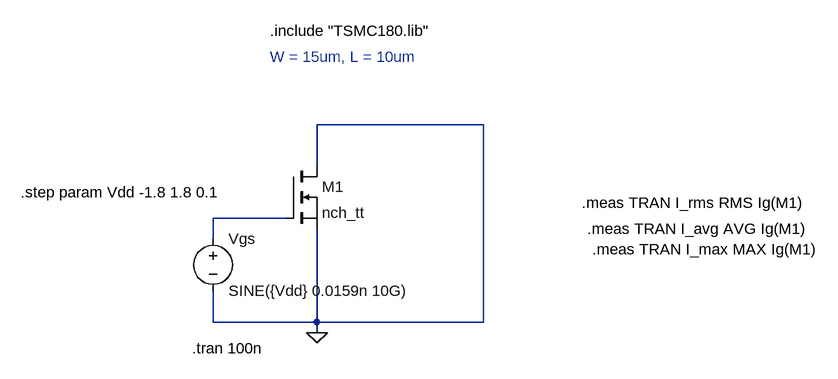
[diagram p0: schematic Q2_nmos_lc.asc]
Q2_nmos_lc.asc, the LTspice schematic file:
Version 4
SHEET 1 1020 680
WIRE 480 128 224 128
WIRE 224 192 224 128
WIRE 176 272 64 272
WIRE 64 304 64 272
WIRE 64 432 64 384
WIRE 224 432 224 288
WIRE 224 432 64 432
WIRE 480 432 480 128
WIRE 480 432 224 432
WIRE 224 448 224 432
FLAG 224 448 0
SYMBOL nmos 176 192 R0
SYMATTR InstName M1
SYMATTR Value nch_tt
SYMATTR Value2 W=15u L=10u
SYMBOL voltage 64 288 R0
WINDOW 123 0 0 Left 0
WINDOW 39 0 0 Left 0
SYMATTR InstName Vgs
SYMATTR Value SINE({Vdd} 0.0159n 10G)
TEXT 152 -16 Left 2 !.include "TSMC180.lib"
TEXT 152 24 Left 2 ;W = 15um, L = 10um
TEXT 32 472 Left 2 !.tran 100n
TEXT -232 232 Left 2 !.step param Vdd -1.8 1.8 0.1
TEXT 632 248 Left 2 !.meas TRAN I_rms RMS Ig(M1)
TEXT 640 288 Left 2 !.meas TRAN I_avg AVG Ig(M1)
TEXT 648 320 Left 2 !.meas TRAN I_max MAX Ig(M1)

The netlist it stands for:
* Q2_nmos_lc.asc
M1 0 N001 0 0 nch_tt W=15u L=10u
Vgs N001 0 SINE({Vdd} 0.0159n 10G)
.model NMOS NMOS
.model PMOS PMOS
.lib standard.mos
.include "TSMC180.lib"
* W = 15um, L = 10um
.tran 100n
.step param Vdd -1.8 1.8 0.1
.meas TRAN I_rms RMS Ig(M1)
.meas TRAN I_avg AVG Ig(M1)
.meas TRAN I_max MAX Ig(M1)
.backanno
.end